# Altium schematic sheet [6] Radio Frequency.SchDoc
size A4; Organization: UNMEI ELECTRICAL; Address1: 16B/12 Nguyen Du Street; Address2: Da Lat City, LD Province; SheetNumber: 6; SheetTotal: 7
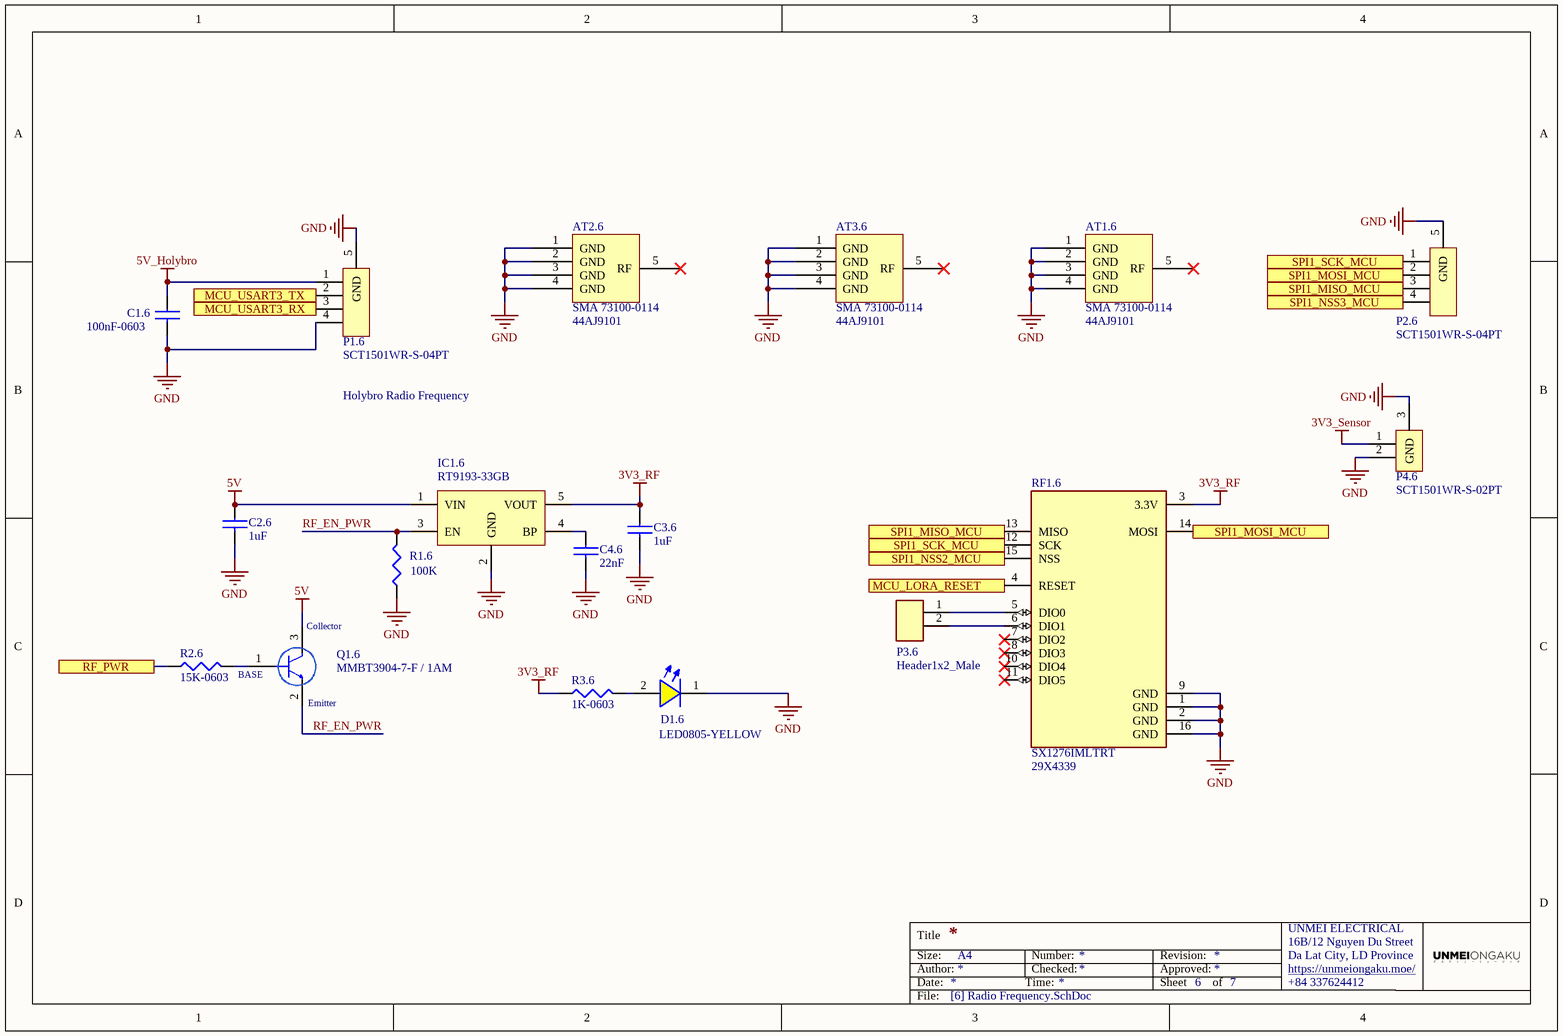
[diagram p0: [6] Radio Frequency.SchDoc]

## Parts
AT1.6  SMA 73100-0114  Supplier Part Number 1: 44AJ9101  [SMA Antenna Connection Jack]
AT2.6  SMA 73100-0114  Supplier Part Number 1: 44AJ9101  [SMA Antenna Connection Jack]
AT3.6  SMA 73100-0114  Supplier Part Number 1: 44AJ9101  [SMA Antenna Connection Jack]
C1.6  100nF-0603  [CAP0603]
C2.6  1uF  [CAP0603]
C3.6  1uF  [CAP0603]
C4.6  22nF  [CAP0603]
D1.6  LED0805-YELLOW  [LED0805-YELLOW]
IC1.6  RT9193-33GB  [SOT23-5]
P1.6  SCT1501WR-S-04PT  [Connector ZH1.5 4P SMD]
P2.6  SCT1501WR-S-04PT  [Connector ZH1.5 4P SMD]
P3.6  Header1x2_Male  [HDR1x2_2.54_MALE]
P4.6  SCT1501WR-S-02PT  [Connector ZH1.5 2P SMD]
Q1.6  MMBT3904-7-F / 1AM  [SOT23]
R1.6  100K  [RES0603 - 3D]
R2.6  15K-0603  [RES0603 - 3D]
R3.6  1K-0603  [RES0603 - 3D]
RF1.6  SX1276IMLTRT  Supplier Part Number 1: 29X4339  [Lora SX1278 433MHz  / Ai-Thinker Ra-02]

## Ports
MCU_LORA_RESET, MCU_USART3_RX, MCU_USART3_TX, RF_PWR, SPI1_MISO_MCU, SPI1_MOSI_MCU, SPI1_NSS2_MCU, SPI1_NSS3_MCU, SPI1_SCK_MCU

## Nets
3V3_RF: C3.6.1 IC1.6.5(VOUT) R3.6.1 RF1.6.3(3.3V)
3V3_Sensor: P4.6.1
5V: C2.6.1 IC1.6.1(VIN) Q1.6.3
5V_Holybro: C1.6.1 P1.6.1
GND: AT1.6.1(GND) AT1.6.2(GND) AT1.6.3(GND) AT1.6.4(GND) AT2.6.1(GND) AT2.6.2(GND) AT2.6.3(GND) AT2.6.4(GND) AT3.6.1(GND) AT3.6.2(GND) AT3.6.3(GND) AT3.6.4(GND) C1.6.2 C2.6.2 C3.6.2 C4.6.2 D1.6.1(+) IC1.6.2(GND) P1.6.4 P1.6.5(GND) P2.6.5(GND) P4.6.2 P4.6.3(GND) R1.6.1 RF1.6.1(GND) RF1.6.2(GND) RF1.6.9(GND) RF1.6.16(GND)
MCU_LORA_RESET: RF1.6.4(RESET) ; port MCU_LORA_RESET
MCU_USART3_RX: P1.6.3 ; port MCU_USART3_RX
MCU_USART3_TX: P1.6.2 ; port MCU_USART3_TX
RF_EN_PWR: IC1.6.3(EN) Q1.6.2 R1.6.2
RF_PWR: R2.6.1 ; port RF_PWR
SPI1_MISO_MCU: P2.6.3 RF1.6.13(MISO) ; port SPI1_MISO_MCU
SPI1_MOSI_MCU: P2.6.2 RF1.6.14(MOSI) ; port SPI1_MOSI_MCU
SPI1_NSS2_MCU: RF1.6.15(NSS) ; port SPI1_NSS2_MCU
SPI1_NSS3_MCU: P2.6.4 ; port SPI1_NSS3_MCU
SPI1_SCK_MCU: P2.6.1 RF1.6.12(SCK) ; port SPI1_SCK_MCU
NetC4.6_1: C4.6.1 IC1.6.4(BP)
NetD1.6_2: D1.6.2(+) R3.6.2
NetP3.6_1: P3.6.1 RF1.6.5(DIO0)
NetP3.6_2: P3.6.2 RF1.6.6(DIO1)
NetQ1.6_1: Q1.6.1 R2.6.2

Not connected (* = marked no-connect by the designer): AT1.6 5(RF)*; AT2.6 5(RF)*; AT3.6 5(RF)*; RF1.6 7(DIO2)* 8(DIO3)* 10(DIO4)* 11(DIO5)*

## Notes on the sheet
- Holybro Radio Frequency
- Title
- Size:
- Date:
- Author:
- A4
- Time:
- Number:
- Checked:
- Revision:
- Sheet
- Approved:
- of
- https://unmeiongaku.moe/
- +84 337624412
- File:
- (in symbol MMBT3904-7-F / 1AM) Collector; BASE; Emitter

## Library data of the parts
AT1.6 AT2.6 AT3.6 = SMA 73100-0114: RF SMA Connector, 1 Contact(s), Female, Board Mount, Solder Terminal, Locking, Receptacle; Manufacturer: Molex; Body Material: Brass; Body Plating: Gold; Dielectric Material: PTFE; Polarity: Normal; Connector Type: PCB,SMA,Coaxial; Impedance: 50R; Frequency: 12Hz; Operating Frequency: 0 to 12Hz; Max Frequency: 18GHz; Voltage Rating: 500V; Supplier 1: Newark; Manufacturer Part Number: 73100-0114; RoHS: Yes; Category: RF / Coaxial Connectors; Stock 1: 2371; Pricing 1: 1=8.21000, 5=7.67000, 10=7.13000, 25=6.72000, 50=6.30000, 100=5.89000 (USD); Mount: Through Hole; Case/Package: SMA; Contact Plating: Gold; Contact Material: Copper; Insulation Material: Teflon; Housing Color: Gold; Plating: Gold; Center Contact Plating: Gold; Min Operating Temperature: -65°C; Max Operating Temperature: 165°C; Package Quantity: 1760; Packaging: Tray; Series: 73100; Termination: Solder; Orientation: Right Angle; Gender: Female; Fastening Type: Threaded; Length: 14.8mm; Radiation Hardening: No; RoHS Compliant: Yes
C1.6 = CC0603KRX7R9BB104: CAP CER 0.1UF 50V X7R 0603; Manufacturer 1: Yageo; Category 1: Capacitors; Capacitance: 0.1µF; Tolerance: ±10%; Value: 100nF; Supplier 1: Digi-Key; Supplier Part Number 1: 311-1344-1-ND; Manufacturer Part Number 1: CC0603KRX7R9BB104; RoHS 1: RoHS Compliant; Description 1: CAP CER 0.1UF 50V X7R 0603; Stock 1: 4411645; Pricing 1: 1=0.1, 10=0.031, 100=0.014, 500=0.00998, 1000=0.00783 (USD); Packaging: Cut Tape (CT); Part Status: Active; Voltage - Rated: 50V; Temperature Coefficient: X7R; Operating Temperature: -55°C ~ 125°C; Features: -; Ratings: -; Applications: General Purpose; Failure Rate: -; Mounting Type: Surface Mount, MLCC; Package / Case: 0603 (1608 Metric); Size / Dimension: 0.063" L x 0.031" W (1.60mm x 0.80mm); Height - Seated (Max): -; Thickness (Max): 0.035" (0.90mm); Lead Spacing: -; Lead Style: -; ComponentLink1URL: http://www.yageo.com/documents/recent/UPY-GPHC_X7R_6.3V-to-50V_18.pdf; ComponentLink1Description: http://www.yageo.com/documents/recent/UPY-GPHC_X7R_6.3V-to-50V_18.pdf
C2.6 C3.6 = CC0603KRX7R7BB105: CAP CER 1UF 16V X7R 0603; Manufacturer 1: Yageo; Category 1: Capacitors; Capacitance: 1µF; Tolerance: ±10%; Supplier 1: Digi-Key; Supplier Part Number 1: 311-1446-1-ND; Manufacturer Part Number 1: CC0603KRX7R7BB105; RoHS 1: RoHS Compliant; Description 1: CAP CER 1UF 16V X7R 0603; Stock 1: 274580; Pricing 1: 1=0.1, 10=0.051, 100=0.0227, 500=0.0162, 1000=0.01274 (USD); Packaging: Cut Tape (CT); Part Status: Active; Voltage - Rated: 16V; Temperature Coefficient: X7R; Operating Temperature: -55°C ~ 125°C; Features: -; Ratings: -; Applications: General Purpose; Failure Rate: -; Mounting Type: Surface Mount, MLCC; Package / Case: 0603 (1608 Metric); Size / Dimension: 0.063" L x 0.031" W (1.60mm x 0.80mm); Height - Seated (Max): -; Thickness (Max): 0.035" (0.90mm); Lead Spacing: -; Lead Style: -; ComponentLink1URL: http://www.yageo.com/documents/recent/UPY-GPHC_X7R_6.3V-to-50V_18.pdf; ComponentLink1Description: http://www.yageo.com/documents/recent/UPY-GPHC_X7R_6.3V-to-50V_18.pdf; Value: 1uF
C4.6 = CC0603KRX7R9BB223: Multilayer Ceramic Capacitors MLCC - SMD/SMT 22nF 50V X7R 10%; Manufacturer: Yageo; Capacitance: 0.022 uF; Type: General Purpose and High Capacitance Surface Mount Ceramic Multilayer Capacitor; Voltage Rating DC: 50 VDC; Capacitance - pF: 22000 pF; Class: Class 2; Supplier 1: Mouser; Manufacturer Part Number: CC0603KRX7R9BB223; RoHS: RoHS Compliant; Category: Multilayer Ceramic Capacitors MLCC - SMD/SMT; Stock 1: 23033; Pricing 1: 1=0.100, 10=0.064, 100=0.020, 1000=0.015, 4000=0.011, 8000=0.010, 24000=0.009 (USD); Height: 0.8 mm; Length: 1.6 mm; Package / Case: 0603 (1608 metric); Packaging: Cut Tape; Product: General Type MLCCs; Series: CC; Termination Style: SMD/SMT; Tolerance: 10 %; Width: 0.8 mm; Brand: Yageo; Capacitance - nF: 22 nF; Case Code - in: 0603; Case Code - mm: 1608; Dielectric: X7R; Maximum Operating Temperature: + 125 C; Minimum Operating Temperature: - 55 C; Product Type: Ceramic Capacitors; Standard Pack Qty: 4000; Subcategory: Capacitors; Termination: Standard; RoHS - Mouser: Y; Minimum Order Quantity: 1; Reeling: True; ComponentLink1URL: https://www.mouser.com/datasheet/2/447/UPY-GPHC_X7R_6.3V-to-50V_18-1154002.pdf; ComponentLink1Description: https://www.mouser.com/datasheet/2/447/UPY-GPHC_X7R_6.3V-to-50V_18-1154002.pdf; Supplier Part Number 1: 603-CC603KRX7R9BB223; Value: 22nF
IC1.6 = RT9193-33GB: IC REG LDO 3.3V 0.3A SOT23-5
P3.6 = HDR1x2_2.54_MALE: Header1x2_2.54_MALE
Q1.6 = MMBT3904-7-F / 1AM: Transistor General Purpose BJT NPN 40 Volt 0.2A Automotive 3-Pin SOT-23; Manufacturer: Diodes Zetex; Collector Emitter Breakdown Voltage: 40V; Max Power Dissipation: 300mW; Max Collector Current: 200mA; Transition Frequency: 300MHz; Collector Base Voltage (VCBO): 60V; Emitter Base Voltage (VEBO): 6V; Collector Emitter Saturation Voltage: 300mV; Element Configuration: Single; hFE Min: 100; Power Dissipation: 350mW; Number of Elements: 1; Supplier 1: Digi-Key; Manufacturer Part Number: MMBT3904-7-F; RoHS: Yes; Category: BJTs; Stock 1: 468030; Pricing 1: 3000=0.02271, 6000=0.02048, 15000=0.01781, 30000=0.01603, 75000=0.01425 (USD); Mount: Surface Mount; Case/Package: SOT-23; Number of Pins: 3; Contact Plating: Tin,Matte; Weight: 0.000282oz; Min Operating Temperature: -55°C; Max Operating Temperature: 150°C; Packaging: Tape and Reel; Polarity: NPN; Package Quantity: 3000; Collector Emitter Voltage (VCEO): 40V; Gain Bandwidth Product: 300MHz; Frequency: 300MHz; Max Breakdown Voltage: 40V; Series: -; Collector-emitter Voltage-Max: 300mV; Voltage Rating (DC): 40V; Max Frequency: 300MHz; Continuous Collector Current: 200mA; Length: 3.05mm; Width: 1.4mm; Height: 1mm; Radiation Hardening: No; RoHS Compliant: Yes; Lead Free: Lead Free; REACH SVHC: No SVHC; ComponentLink1URL: https://datasheet.ciiva.com/11201/ds30036-11201778.pdf?src-supplier=Avnet; ComponentLink1Description: https://datasheet.ciiva.com/11201/ds30036-11201778.pdf?src-supplier=Avnet; ComponentLink2URL: https://datasheet.ciiva.com/15138/getdatasheetpartid-53265-15138780.pdf?src-supplier=Verical; ComponentLink2Description: https://datasheet.ciiva.com/15138/getdatasheetpartid-53265-15138780.pdf?src-supplier=Verical; ComponentLink3URL: https://datasheet.ciiva.com/22711/1915516-22711750.pdf?src-supplier=Element14; ComponentLink3Description: https://datasheet.ciiva.com/22711/1915516-22711750.pdf?src-supplier=Element14; ComponentLink4URL: https://datasheet.ciiva.com/11198/ds30036-11198999.pdf?src-supplier=Avnet; ComponentLink4Description: https://datasheet.ciiva.com/11198/ds30036-11198999.pdf?src-supplier=Avnet; ComponentLink5URL: https://datasheet.ciiva.com/6361/ds30036-6361256.pdf?src-supplier=Digi-Key; ComponentLink5Description: https://datasheet.ciiva.com/6361/ds30036-6361256.pdf?src-supplier=Digi-Key; ComponentLink6URL: https://datasheet.ciiva.com/6361/ds30036-6361254.pdf?src-supplier=Digi-Key; ComponentLink6Description: https://datasheet.ciiva.com/6361/ds30036-6361254.pdf?src-supplier=Digi-Key; Supplier Part Number 1: MMBT3904-FDITR-ND
R1.6 = RC0603JR-07100KL: RES SMD 100K OHM 5% 1/10W 0603; Manufacturer 1: Yageo; Category 1: Resistors; Power (Watts): 0.1W, 1/10W; Temperature Coefficient: ±100ppm/°C; Supplier 1: Digi-Key; Supplier Part Number 1: 311-100KGRCT-ND; Manufacturer Part Number 1: RC0603JR-07100KL; RoHS 1: RoHS Compliant; Description 1: RES SMD 100K OHM 5% 1/10W 0603; Stock 1: 3591837; Pricing 1: 1=0.1, 10=0.011, 100=0.0044, 1000=0.00198, 2500=0.00172 (USD); Packaging: Cut Tape (CT); Part Status: Active; Resistance (Ohms): 100k; Tolerance: ±5%; Composition: Thick Film; Features: Moisture Resistant; Operating Temperature: -55°C ~ 155°C; Package / Case: 0603 (1608 Metric); Supplier Device Package: 0603; Size / Dimension: 0.063" L x 0.031" W (1.60mm x 0.80mm); Height - Seated (Max): 0.022" (0.55mm); Failure Rate: -; ComponentLink1URL: http://www.yageo.com/documents/recent/PYu-RC_Group_51_RoHS_L_7.pdf; ComponentLink1Description: http://www.yageo.com/documents/recent/PYu-RC_Group_51_RoHS_L_7.pdf; Value: 100K
R2.6 = RC0603JR-0715KL: Thick Film Resistors - SMD 15K OHM 5%; Manufacturer: Yageo; Power Rating: 100 mW, 200 mW; Resistance: 15 kOhms; Temperature Coefficient: 100 PPM / C; Voltage Rating: 75 V; Supplier 1: Mouser; Manufacturer Part Number: RC0603JR-0715KL; RoHS: RoHS Compliant; Category: Thick Film Resistors - SMD; Stock 1: 39889; Pricing 1: 1=0.100, 10=0.015, 100=0.005, 1000=0.004, 5000=0.004 (USD); Application: High Reliability; Features: -; Height: 0.45 mm; Length: 1.6 mm; Package / Case: 0603 (1608 metric); Packaging: Cut Tape; Product: Thick Film Resistors SMD; Series: RC; Technology: Thick Film; Termination Style: SMD/SMT; Tolerance: 5 %; Type: General Purpose; Width: 0.8 mm; Brand: Yageo; Mounting Style: PCB Mount; Case Code - in: 0603; Case Code - mm: 1608; Maximum Operating Temperature: + 155 C; Minimum Operating Temperature: - 55 C; Product Type: Thick Film Resistors; Standard Pack Qty: 5000; Subcategory: Resistors; RoHS - Mouser: Y; Minimum Order Quantity: 1; Reeling: True; ComponentLink1URL: http://www.mouser.com/datasheet/2/447/PYu-RC_Group_51_RoHS_L_9-1314892.pdf; ComponentLink1Description: http://www.mouser.com/datasheet/2/447/PYu-RC_Group_51_RoHS_L_9-1314892.pdf; Supplier Part Number 1: 603-RC0603JR-0715KL; Value: 15K
R3.6 = RC0603JR-071KL: RES SMD 1K OHM 5% 1/10W 0603; Manufacturer 1: Yageo; Category 1: Resistors; Power (Watts): 0.1W, 1/10W; Temperature Coefficient: ±100ppm/°C; Supplier 1: Digi-Key; Supplier Part Number 1: 311-1.0KGRCT-ND; Manufacturer Part Number 1: RC0603JR-071KL; RoHS 1: RoHS Compliant; Description 1: RES SMD 1K OHM 5% 1/10W 0603; Stock 1: 2853955; Pricing 1: 1=0.1, 10=0.011, 100=0.0044, 1000=0.00198, 2500=0.00172 (USD); Packaging: Cut Tape (CT); Part Status: Active; Resistance (Ohms): 1k; Tolerance: ±5%; Composition: Thick Film; Features: Moisture Resistant; Operating Temperature: -55°C ~ 155°C; Package / Case: 0603 (1608 Metric); Supplier Device Package: 0603; Size / Dimension: 0.063" L x 0.031" W (1.60mm x 0.80mm); Height - Seated (Max): 0.022" (0.55mm); Failure Rate: -; ComponentLink1URL: http://www.yageo.com/documents/recent/PYu-RC_Group_51_RoHS_L_7.pdf; ComponentLink1Description: http://www.yageo.com/documents/recent/PYu-RC_Group_51_RoHS_L_7.pdf; Value: 1K
RF1.6 = SX1276IMLTRT: Rf Ism Transceiver Fsk/gfsk/gmsk/msk/ook 3.3V Automotive 28-PIN QFN Ep T/r; Manufacturer: Semtech; Frequency: 137MHz; Data Rate: 300Kbps; Sensitivity: -148dBm; Number of GPIO: 6; Interface: SPI; Current - Receiving: 12mA; Current - Transmitting: 120mA; Operating Supply Voltage: 3.7V; Supplier 1: Newark; Manufacturer Part Number: SX1276IMLTRT; RoHS: Yes; Category: RF Receivers, Transceivers; Stock 1: 2848; Pricing 1: 1=9.90000, 10=9.04000, 25=8.28000, 50=7.88000, 100=7.47000, 250=6.87000, 500=6.24000 (USD); Case/Package: VQFN; Min Operating Temperature: -40°C; Max Operating Temperature: 85°C; Packaging: Tape and Reel; Package Quantity: 3000; Lead Free: Lead Free; RoHS Compliant: Yes; ComponentLink1URL: https://datasheet.ciiva.com/29635/sx1276-29635606.pdf?src-supplier=Digi-Key; ComponentLink1Description: https://datasheet.ciiva.com/29635/sx1276-29635606.pdf?src-supplier=Digi-Key; ComponentLink2URL: https://datasheet.ciiva.com/29635/sx1276-29635607.pdf?src-supplier=Digi-Key; ComponentLink2Description: https://datasheet.ciiva.com/29635/sx1276-29635607.pdf?src-supplier=Digi-Key; ComponentLink3URL: https://datasheet.ciiva.com/29635/sx1276-29635605.pdf?src-supplier=Digi-Key; ComponentLink3Description: https://datasheet.ciiva.com/29635/sx1276-29635605.pdf?src-supplier=Digi-Key